# Altium schematic sheet Main.SchDoc
size 420 x 297 mm; SheetNumber: 1; SheetTotal: 1
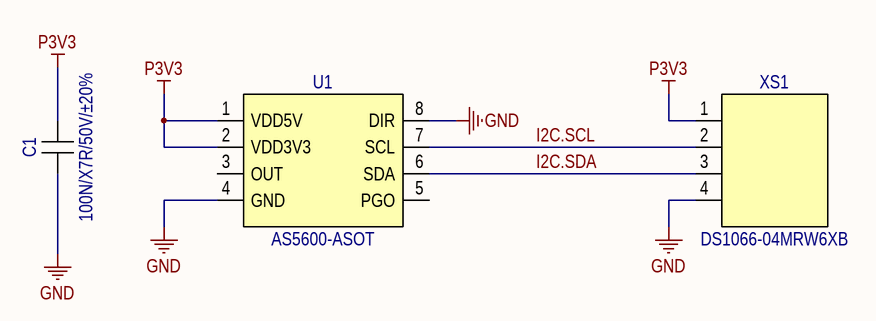
[diagram p0: Main.SchDoc]

## Parts
C1  value 100N/X7R/50V/±20%  [Normal_Capacitor_Standard_0805-L2000-W1250-BW500-H1350]  (hidden comment: CL21B104MBFNNNE)
U1  AS5600-ASOT  [8-SOIC]
XS1  DS1066-04MRW6XB  [DS1066-04MRW6XB]

## Nets
GND: C1.1 U1.4(GND) U1.8(DIR) XS1.4
P3V3: C1.2 U1.1(VDD5V) U1.2(VDD3V3) XS1.1
I2C.SCL: U1.7(SCL) XS1.2
I2C.SDA: U1.6(SDA) XS1.3

Not connected (* = marked no-connect by the designer): U1 3(OUT) 5(PGO)

## Notes on the sheet
- Подп. и дата
- Инв. № дубл.
- Взам. инв. №
- Изм.
- Разраб.
- Лист
- № докум.
- Подп.
- Дата
- Лит.
- Масса
- Масштаб
- Утв.
- Листов
- Инв № подл.
- Формат А3

## Library data of the parts
C1 = CL21B104MBFNNNE: Ceramic Capacitor SMD 0805; Manufacturer: SAMSUNG ELECTRO-MECHANICS
XS1 = DS1066-04MRW6XB: Manufacturer: CONNFLY ELECTRONIC CO.,LTD.